# Altium project Pleiades_P01.PrjPcb (part 3 of 10)

## Sheet POWER_FPGA.SchDoc
size Tabloid; SheetNumber: 23; SheetTotal: 25; Sheet_Name: POWER; Size: 11x17
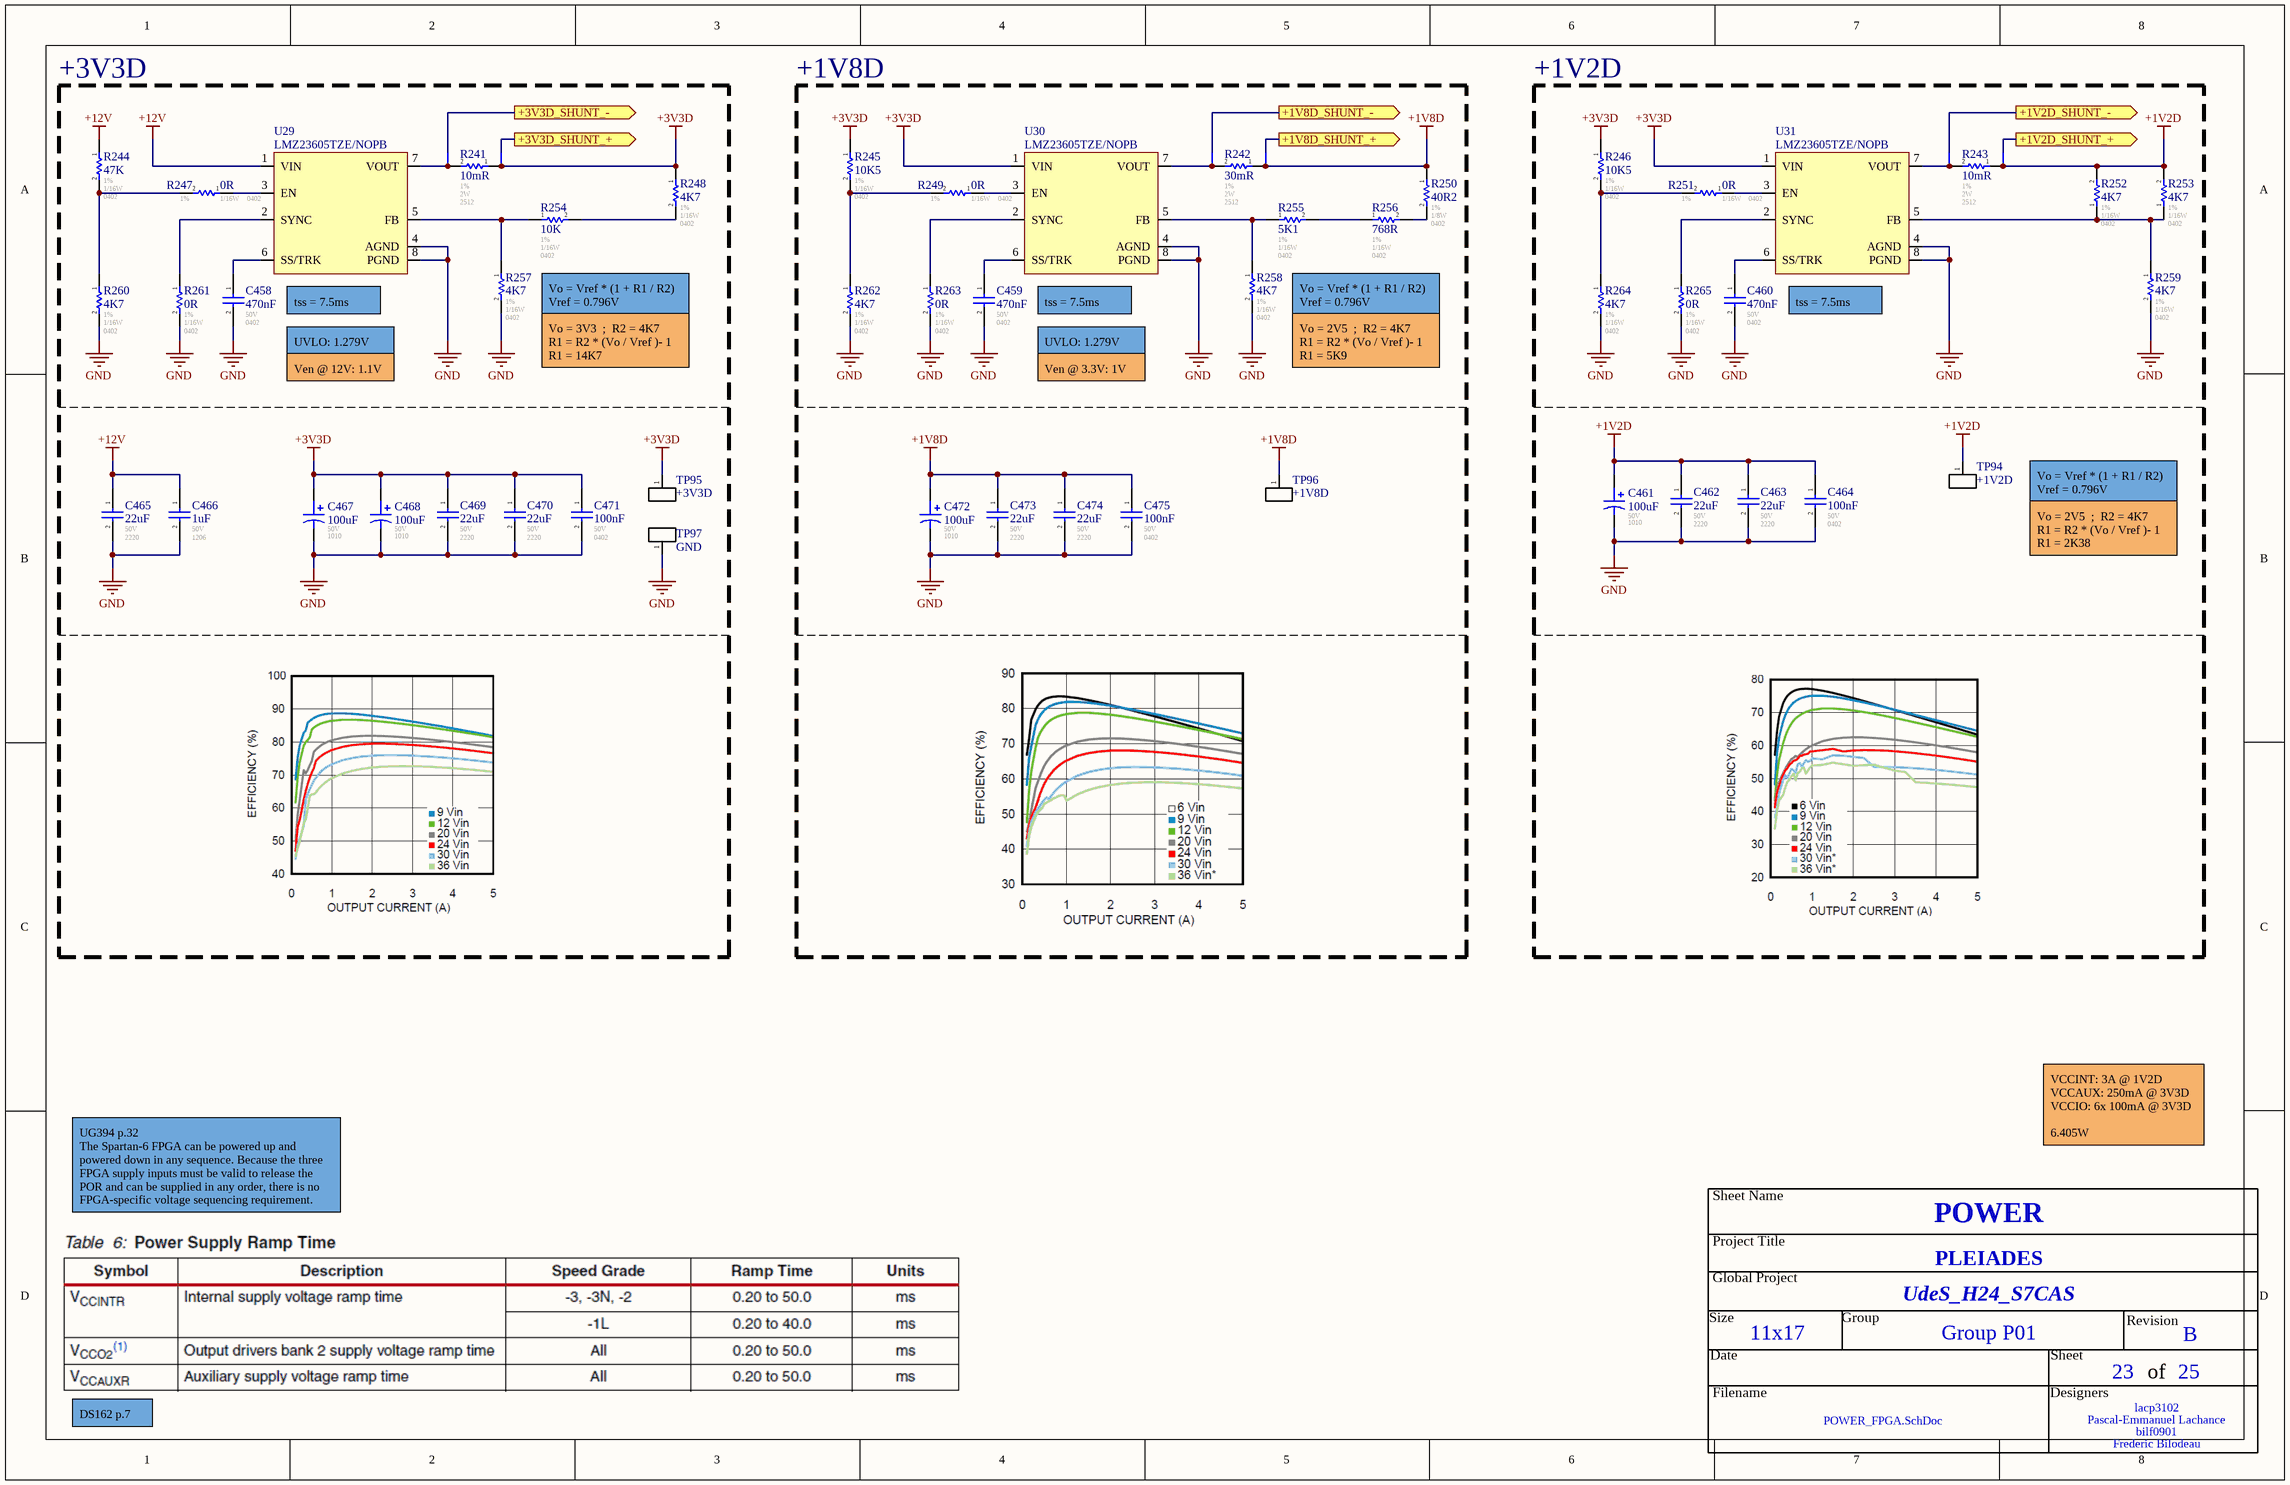
[diagram p16: POWER_FPGA.SchDoc]

### Parts
C458  470nF  Voltage - Rated: 50V  Footprint: 0402  [CAP_0402]
C459  470nF  Voltage - Rated: 50V  Footprint: 0402  [CAP_0402]
C460  470nF  Voltage - Rated: 50V  Footprint: 0402  [CAP_0402]
C461  value 100uF  Voltage: 50V  Package: 1010  [CAP_ALU_1010_vishay]  (hidden comment: MAL215099101E3)
C462  22uF  Voltage - Rated: 50V  Footprint: 2220  [CAP_2220]
C463  22uF  Voltage - Rated: 50V  Footprint: 2220  [CAP_2220]
C464  100nF  Voltage - Rated: 50V  Footprint: 0402  [CAP_0402]
C465  22uF  Voltage - Rated: 50V  Footprint: 2220  [CAP_2220]
C466  1uF  Voltage - Rated: 50V  Footprint: 1206  [CAP_1206]
C467  value 100uF  Voltage: 50V  Package: 1010  [CAP_ALU_1010_vishay]  (hidden comment: MAL215099101E3)
C468  value 100uF  Voltage: 50V  Package: 1010  [CAP_ALU_1010_vishay]  (hidden comment: MAL215099101E3)
C469  22uF  Voltage - Rated: 50V  Footprint: 2220  [CAP_2220]
C470  22uF  Voltage - Rated: 50V  Footprint: 2220  [CAP_2220]
C471  100nF  Voltage - Rated: 50V  Footprint: 0402  [CAP_0402]
C472  value 100uF  Voltage: 50V  Package: 1010  [CAP_ALU_1010_vishay]  (hidden comment: MAL215099101E3)
C473  22uF  Voltage - Rated: 50V  Footprint: 2220  [CAP_2220]
C474  22uF  Voltage - Rated: 50V  Footprint: 2220  [CAP_2220]
C475  100nF  Voltage - Rated: 50V  Footprint: 0402  [CAP_0402]
NT46  Net Tie  [NETTIE_5]  (value not drawn)  (net tie, no BOM)
NT47  Net Tie  [NETTIE_5]  (value not drawn)  (net tie, no BOM)
NT48  Net Tie  [NETTIE_5]  (value not drawn)  (net tie, no BOM)
NT49  Net Tie  [NETTIE_5]  (value not drawn)  (net tie, no BOM)
NT50  Net Tie  [NETTIE_5]  (value not drawn)  (net tie, no BOM)
NT51  Net Tie  [NETTIE_5]  (value not drawn)  (net tie, no BOM)
R241  10mR  Tolerance: 1%  Power: 2W  Package / Case: 2512  [RES_2512]
R242  30mR  Tolerance: 1%  Power: 2W  Package / Case: 2512  [RES_2512]
R243  10mR  Tolerance: 1%  Power: 2W  Package / Case: 2512  [RES_2512]
R244  47K  Tolerance: 1%  Power: 1/16W  Package / Case: 0402  [RES_0402]
R245  10K5  Tolerance: 1%  Power: 1/16W  Package / Case: 0402  [RES_0402]
R246  10K5  Tolerance: 1%  Power: 1/16W  Package / Case: 0402  [RES_0402]
R247  0R  Tolerance: 1%  Power: 1/16W  Package / Case: 0402  [RES_0402]
R248  4K7  Tolerance: 1%  Power: 1/16W  Package / Case: 0402  [RES_0402]
R249  0R  Tolerance: 1%  Power: 1/16W  Package / Case: 0402  [RES_0402]
R250  40R2  Tolerance: 1%  Power: 1/8W  Package / Case: 0402  [RES_0402]
R251  0R  Tolerance: 1%  Power: 1/16W  Package / Case: 0402  [RES_0402]
R252  4K7  Tolerance: 1%  Power: 1/16W  Package / Case: 0402  [RES_0402]
R253  4K7  Tolerance: 1%  Power: 1/16W  Package / Case: 0402  [RES_0402]
R254  10K  Tolerance: 1%  Power: 1/16W  Package / Case: 0402  [RES_0402]
R255  5K1  Tolerance: 1%  Power: 1/16W  Package / Case: 0402  [RES_0402]
R256  768R  Tolerance: 1%  Power: 1/16W  Package / Case: 0402  [RES_0402]
R257  4K7  Tolerance: 1%  Power: 1/16W  Package / Case: 0402  [RES_0402]
R258  4K7  Tolerance: 1%  Power: 1/16W  Package / Case: 0402  [RES_0402]
R259  4K7  Tolerance: 1%  Power: 1/16W  Package / Case: 0402  [RES_0402]
R260  4K7  Tolerance: 1%  Power: 1/16W  Package / Case: 0402  [RES_0402]
R261  0R  Tolerance: 1%  Power: 1/16W  Package / Case: 0402  [RES_0402]
R262  4K7  Tolerance: 1%  Power: 1/16W  Package / Case: 0402  [RES_0402]
R263  0R  Tolerance: 1%  Power: 1/16W  Package / Case: 0402  [RES_0402]
R264  4K7  Tolerance: 1%  Power: 1/16W  Package / Case: 0402  [RES_0402]
R265  0R  Tolerance: 1%  Power: 1/16W  Package / Case: 0402  [RES_0402]
TP94  +1V2D  [TP_HOLE]  (no BOM)
TP95  +3V3D  [TP_HOLE]  (no BOM)
TP96  +1V8D  [TP_HOLE]  (no BOM)
TP97  GND  [TP_HOLE]  (no BOM)
U29  LMZ23605TZE/NOPB  [REG_SWR_LMZ23605TZE/NOPB]
U30  LMZ23605TZE/NOPB  [REG_SWR_LMZ23605TZE/NOPB]
U31  LMZ23605TZE/NOPB  [REG_SWR_LMZ23605TZE/NOPB]

### Blocks framed on the sheet
+3V3D: C458 C465-C471 NT46 NT47 R241 R244 R247 R248 R254 R257 R260 R261 TP95 TP97 U29
+1V8D: C459 C472-C475 NT48 NT49 R242 R245 R249 R250 R255 R256 R258 R262 R263 TP96 U30
+1V2D: C460-C464 NT50 NT51 R243 R246 R251-R253 R259 R264 R265 TP94 U31

### Ports
+1V2D_SHUNT_+ (out), +1V2D_SHUNT_- (out), +1V8D_SHUNT_+ (out), +1V8D_SHUNT_- (out), +3V3D_SHUNT_+ (out), +3V3D_SHUNT_- (out)

### Nets
+1V2D: C461.1 C462.1 C463.1 C464.1 NT51.1 R243.1 R252.2 R253.2 TP94.1(A)
+1V8D: C472.1 C473.1 C474.1 C475.1 NT49.1 R242.1 R250.1 TP96.1(A)
+3V3D: C467.1 C468.1 C469.1 C470.1 C471.1 NT47.1 R241.1 R245.1 R246.1 R248.1 TP95.1(A) U30.1(VIN) U31.1(VIN)
+12V: C465.1 C466.1 R244.1 U29.1(VIN)
GND: C458.2 C459.2 C460.2 C461.2 C462.2 C463.2 C464.2 C465.2 C466.2 C467.2 C468.2 C469.2 C470.2 C471.2 C472.2 C473.2 C474.2 C475.2 R257.2 R258.2 R259.2 R260.2 R261.2 R262.2 R263.2 R264.2 R265.2 TP97.1(A) U29.4(AGND) U29.8(PGND) U30.4(AGND) U30.8(PGND) U31.4(AGND) U31.8(PGND)
+1V2D_SHUNT_+: NT51.2 ; port +1V2D_SHUNT_+
+1V2D_SHUNT_-: NT50.2 ; port +1V2D_SHUNT_-
+1V8D_SHUNT_+: NT49.2 ; port +1V8D_SHUNT_+
+1V8D_SHUNT_-: NT48.2 ; port +1V8D_SHUNT_-
+3V3D_SHUNT_+: NT47.2 ; port +3V3D_SHUNT_+
+3V3D_SHUNT_-: NT46.2 ; port +3V3D_SHUNT_-
NetC458_1: C458.1 U29.6(SS/TRK)
NetC459_1: C459.1 U30.6(SS/TRK)
NetC460_1: C460.1 U31.6(SS/TRK)
NetNT46_1: NT46.1 R241.2 U29.7(VOUT)
NetNT48_1: NT48.1 R242.2 U30.7(VOUT)
NetNT50_1: NT50.1 R243.2 U31.7(VOUT)
NetR244_2: R244.2 R247.2 R260.1
NetR245_2: R245.2 R249.2 R262.1
NetR246_2: R246.2 R251.2 R264.1
NetR247_1: R247.1 U29.3(EN)
NetR248_2: R248.2 R254.2
NetR249_1: R249.1 U30.3(EN)
NetR250_2: R250.2 R256.2
NetR251_1: R251.1 U31.3(EN)
NetR252_1: R252.1 R253.1 R259.1 U31.5(FB)
NetR254_1: R254.1 R257.1 U29.5(FB)
NetR255_1: R255.1 R258.1 U30.5(FB)
NetR255_2: R255.2 R256.1
NetR261_1: R261.1 U29.2(SYNC)
NetR263_1: R263.1 U30.2(SYNC)
NetR265_1: R265.1 U31.2(SYNC)

### Notes on the sheet
- (near U29) tss = 7.5ms
- UVLO: 1.279V
- Vo = Vref * (1 + R1 / R2)
  Vref = 0.796V
- (near R257) Vo = 3V3  ;  R2 = 4K7
  R1 = R2 * (Vo / Vref )- 1
  R1 = 14K7
- (near U30) tss = 7.5ms
- (near R258) Vo = 2V5  ;  R2 = 4K7
  R1 = R2 * (Vo / Vref )- 1
  R1 = 5K9
- (near U31) tss = 7.5ms
- Ven @ 12V: 1.1V
- Ven @ 3.3V: 1V
- Vo = 2V5  ;  R2 = 4K7
  R1 = R2 * (Vo / Vref )- 1
  R1 = 2K38
- VCCINT: 3A @ 1V2D
  VCCAUX: 250mA @ 3V3D
  VCCIO: 6x 100mA @ 3V3D
  6.405W
- UG394 p.32
  The Spartan-6 FPGA can be powered up and powered down in any sequence. Because the three FPGA supply inputs must be valid to release the POR and can be supplied in any order, there is no FPGA-specific voltage sequencing requirement.
- DS162 p.7
- Sheet Name
- Project Title
- Global Project
- Revision
- Size
- Date
- Group
- Sheet
- of
- Filename
- Designers

### Library data of the parts
C458-C460 = CAP_CER: CGA3E3X7R1H474K080AB / 0603 470nF 10% X7R Ceramic Capacitor; Mfr: TDK; Operating Temperature: -55C - 125C; Temperature Coefficient: X7R; ComponentLink1Description: Digikey; ComponentLink1URL: [Digikey Link]; Part#: CGA3E3X7R1H474K080AB; ComponentLink2Description: Datasheet; ComponentLink2URL: [Datasheet Link]; Tolerance: 10%; Ratings: AEC-Q200
C461 C467 C468 C472 = CAP_ALU_MAL215099101E3: CAP - ALU 100uF 20% 50V - 1010; Current: 490mA; Mfg: Vishay Dale; Mfg Part Number: MAL215099101E3; HelpURL: http://www.vishay.com/docs/28395/150crz.pdf; CreatedBy: Jonathan Bouchard; Temperature: -55°C to 125°C; Power: *; Supplier 1: Digikey; Supplier Part Number 1: 4399PHDKR-ND; Precision: 20%
C462 C463 C465 C469 C470 C473 C474 = CAP_CER: CGA9P3X7R1H226M250KB / 2220 22uF 20% X7R Ceramic Capacitor; Mfr: TDK; Operating Temperature: -55C - 125C; Temperature Coefficient: X7R; ComponentLink1Description: Digikey; ComponentLink1URL: https://www.digikey.ca/en/products/detail/tdk-corporation/CGA9P3X7R1H226M250KB/10240627; ComponentLink2Description: Datasheet; ComponentLink2URL: https://product.tdk.com/system/files/dam/doc/product/capacitor/ceramic/mlcc/charasheet/cga9p3x7r1h226m250kb.pdf; Tolerance: 20%; Ratings: AEC-Q200; Part#: CGA9P3X7R1H226M250KB; Supplier 1: Arrow Electronics; Supplier Part Number 1: CGA9P3X7R1H226M250KB; ComponentLink3Description: TDK; ComponentLink3URL: https://product.tdk.com/en/search/capacitor/ceramic/mlcc/info?part_no=CGA9P3X7R1H226M250KB; ComponentLink4Description: Octopart; ComponentLink4URL: https://octopart.com/cga9p3x7r1h226m250kb-tdk-102764996?r=sp
C464 C471 C475 = CAP_CER: GCM155R71H104KE02J / 0402 100nF 10% X7R Ceramic Capacitor; Mfr: Murata; Operating Temperature: -55C - 125C; Temperature Coefficient: X7R; ComponentLink1Description: Digikey; ComponentLink1URL: [Digikey Link]; Part#: GCM155R71H104KE02J; ComponentLink2Description: Datasheet; ComponentLink2URL: [Datasheet Link]; Tolerance: 10%; Ratings: AEC-Q200
C466 = CAP_CER: GCJ31CR71H105KA12L / 1206 1uF 10% X7R Ceramic Capacitor; Mfr: Murata; Operating Temperature: -55C - 125C; Temperature Coefficient: X7R; ComponentLink1Description: Digikey; ComponentLink1URL: [Digikey Link]; Part#: GCJ31CR71H105KA12L; ComponentLink2Description: Datasheet; ComponentLink2URL: [Datasheet Link]; Tolerance: 10%; Ratings: AEC-Q200
NT46-NT51 = NET_TIE_SMALL
R241 R243 = RESISTOR: CSRN2512FK10L0; Automotive: AEC-Q200; Operating Temperature: -55C - 155C; ComponentLink1Description: Digikey; ComponentLink1URL: https://www.digikey.ca/fr/products/detail/stackpole-electronics-inc/CSRN2512FK10L0/1646104; Part #: CSRN2512FK10L0
R242 = RESISTOR: CSRN2512FK30L0; Automotive: AEC-Q200; Operating Temperature: -55C - 155C; ComponentLink1Description: Digikey; ComponentLink1URL: https://www.digikey.ca/fr/products/detail/stackpole-electronics-inc/CSRN2512FK30L0/1646107; Part #: CSRN2512FK30L0
R244-R265 = RESISTOR: Automotive: AEC-Q200; Operating Temperature: *; # Digikey: *; ComponentLink1Description: Digikey; ComponentLink1URL: *; # Manufacturer: *
TP94-TP97 = TESTPOINT: Test Point; ClassName: Testpoint
U29-U31 = REG_SWR_LMZ23605TZE/NOPB: REG - IC BUCK SYNC 36V 5A - TO-PMOD-7; Manufacturer #1: Texas Instruments; Value: 0.8 ~ 6 V; Voltage Rating: 6 ~ 36 V; GRAMS Lib Spec: 2.8; Note: One Reflow; Magnetic Material: YES; Cryo: UNKNOWN; Tolerance: *; Current Rating: 5A; Power Max: *; HelpURL: http://www.ti.com/lit/ds/symlink/lmz23605.pdf; CreatedBy/Date: Arnaud Samson - 05/07/18; VerifiedBy: Jonathan Bouchard 2018-07-13; Temperature: -40°C ~ 125°C; Package: TO-PMOD-7; Manufacturer #2: *; Assembly Type: SMD; Part Number #2: *; Part Number #1: LMZ23605TZE/NOPB; Polarized: YES; Supplier 1: Digi-Key; Supplier Part Number 1: 296-35357-1-ND

## Sheet POWER_DDR3.SchDoc
size Tabloid; SheetNumber: 22; SheetTotal: 25; Sheet_Name: DDR3 POWER; Size: 11x17
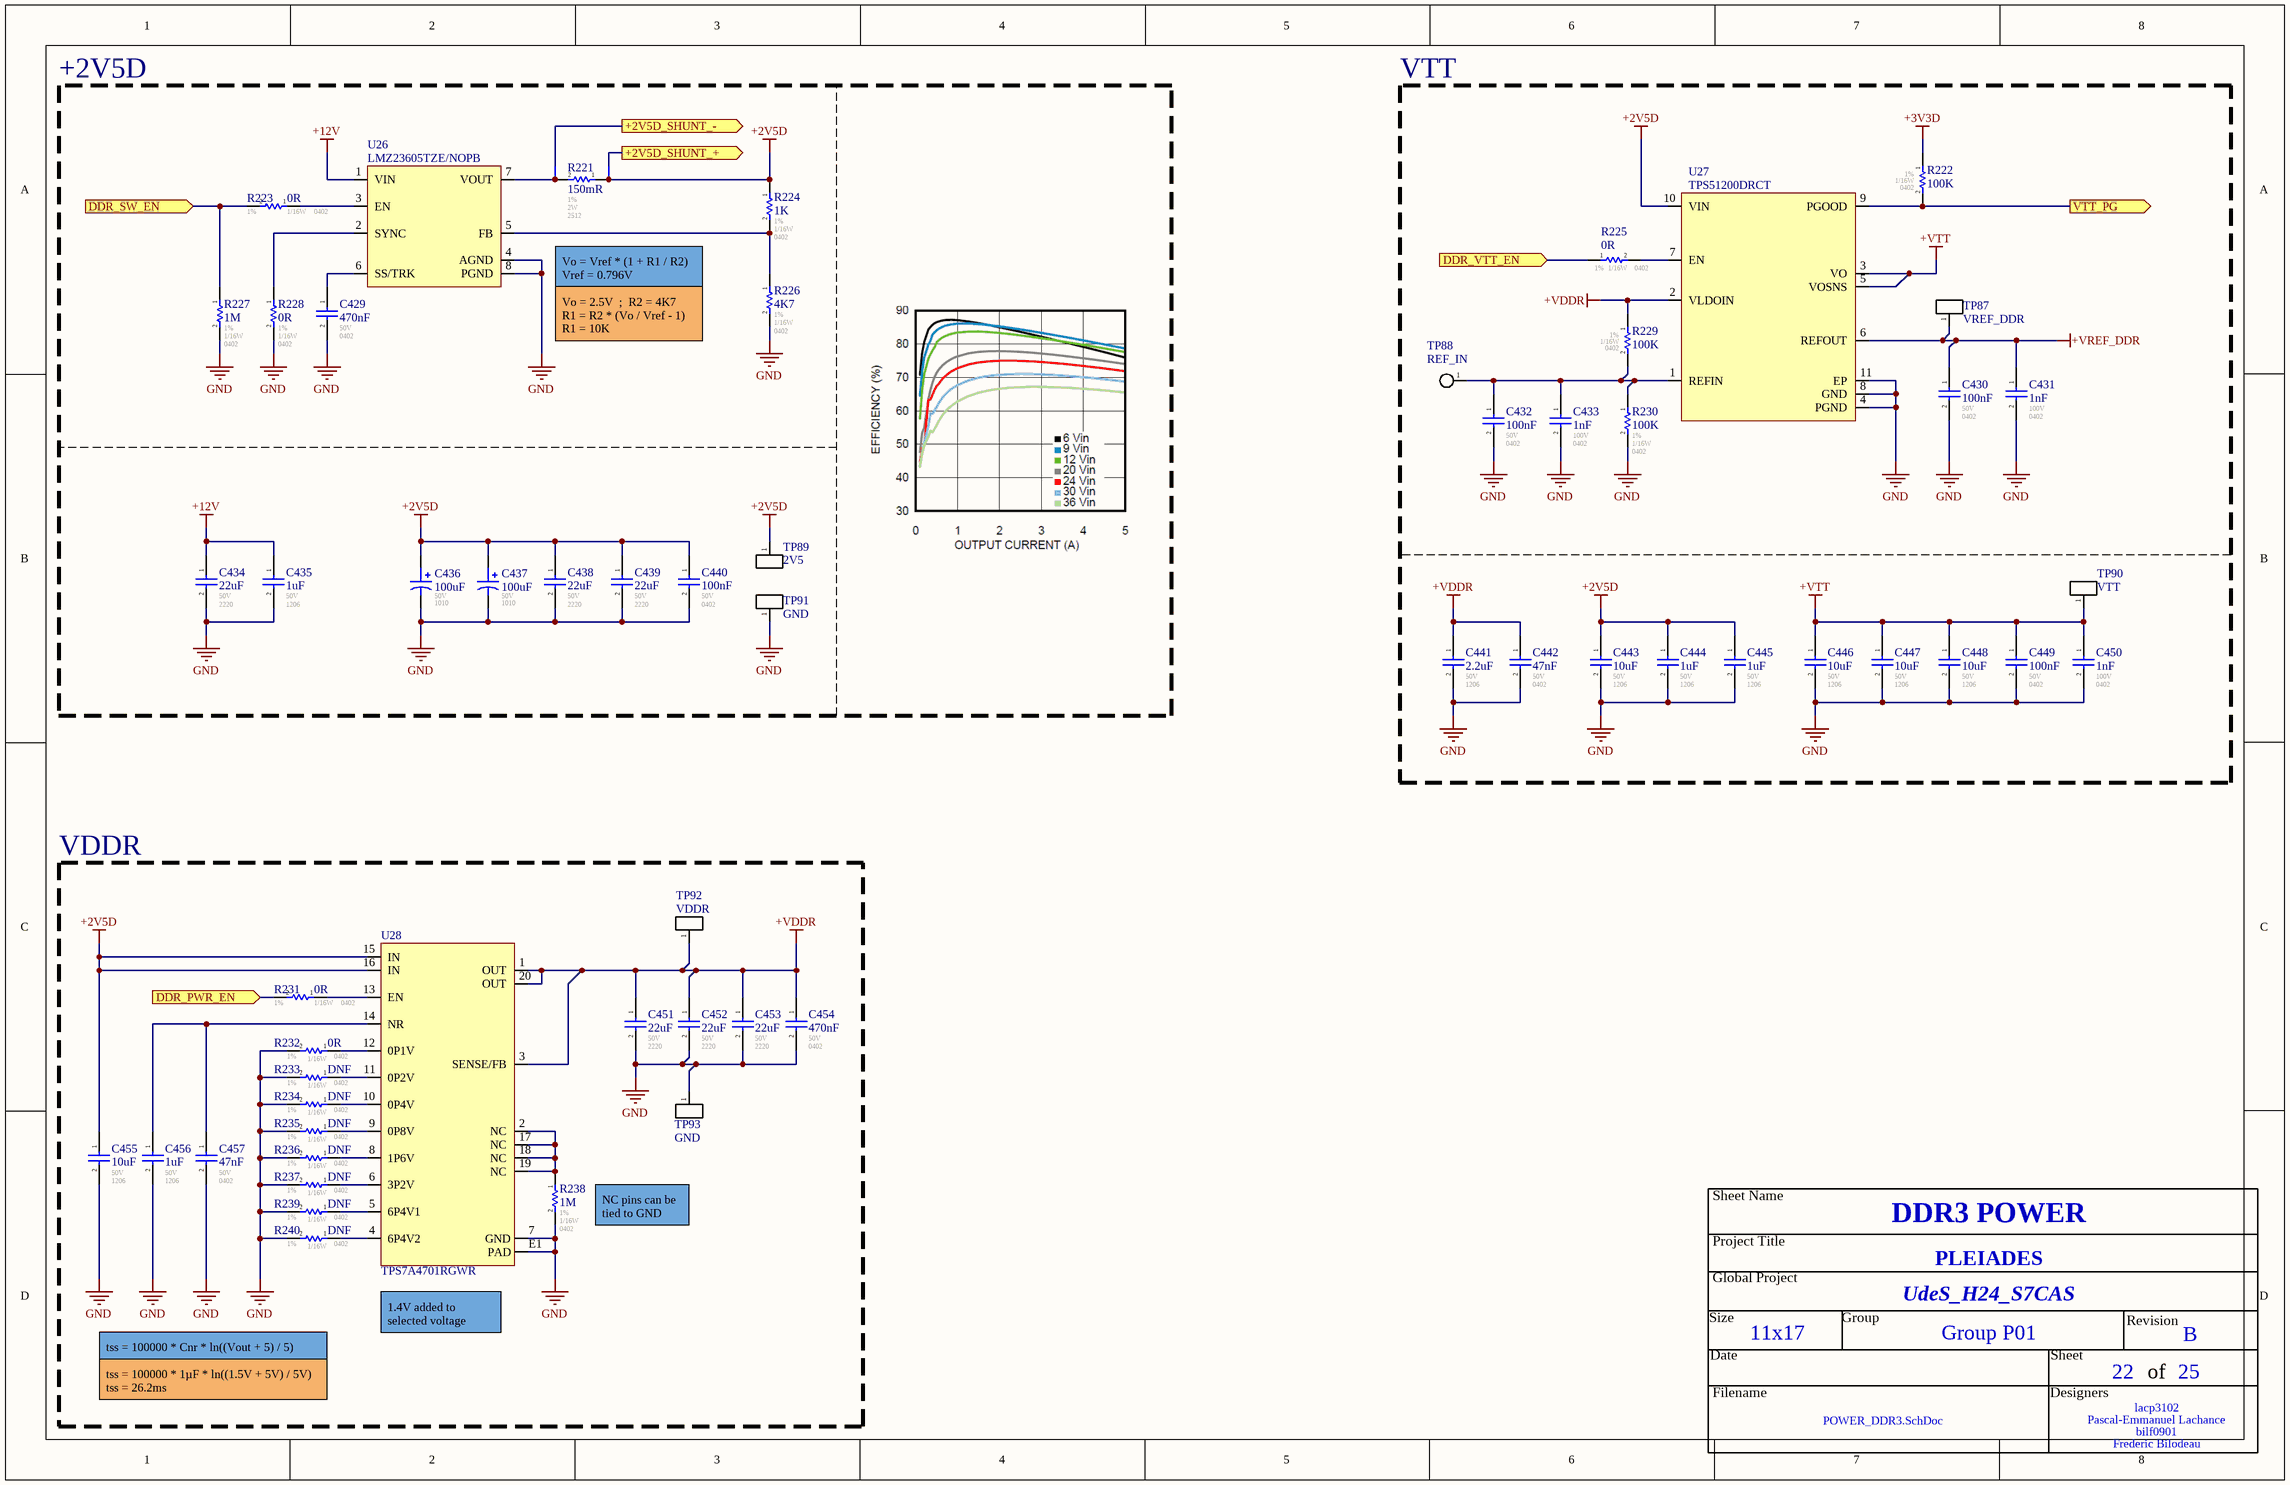
[diagram p17: POWER_DDR3.SchDoc]

### Parts
C429  470nF  Voltage - Rated: 50V  Footprint: 0402  [CAP_0402]
C430  100nF  Voltage - Rated: 50V  Footprint: 0402  [CAP_0402]
C431  1nF  Voltage - Rated: 100V  Footprint: 0402  [CAP_0402]
C432  100nF  Voltage - Rated: 50V  Footprint: 0402  [CAP_0402]
C433  1nF  Voltage - Rated: 100V  Footprint: 0402  [CAP_0402]
C434  22uF  Voltage - Rated: 50V  Footprint: 2220  [CAP_2220]
C435  1uF  Voltage - Rated: 50V  Footprint: 1206  [CAP_1206]
C436  value 100uF  Voltage: 50V  Package: 1010  [CAP_ALU_1010_vishay]  (hidden comment: MAL215099101E3)
C437  value 100uF  Voltage: 50V  Package: 1010  [CAP_ALU_1010_vishay]  (hidden comment: MAL215099101E3)
C438  22uF  Voltage - Rated: 50V  Footprint: 2220  [CAP_2220]
C439  22uF  Voltage - Rated: 50V  Footprint: 2220  [CAP_2220]
C440  100nF  Voltage - Rated: 50V  Footprint: 0402  [CAP_0402]
C441  2.2uF  Voltage - Rated: 50V  Footprint: 1206  [CAP_1206]
C442  47nF  Voltage - Rated: 50V  Footprint: 0402  [CAP_0402]
C443  10uF  Voltage - Rated: 50V  Footprint: 1206  [CAP_1206]
C444  1uF  Voltage - Rated: 50V  Footprint: 1206  [CAP_1206]
C445  1uF  Voltage - Rated: 50V  Footprint: 1206  [CAP_1206]
C446  10uF  Voltage - Rated: 50V  Footprint: 1206  [CAP_1206]
C447  10uF  Voltage - Rated: 50V  Footprint: 1206  [CAP_1206]
C448  10uF  Voltage - Rated: 50V  Footprint: 1206  [CAP_1206]
C449  100nF  Voltage - Rated: 50V  Footprint: 0402  [CAP_0402]
C450  1nF  Voltage - Rated: 100V  Footprint: 0402  [CAP_0402]
C451  22uF  Voltage - Rated: 50V  Footprint: 2220  [CAP_2220]
C452  22uF  Voltage - Rated: 50V  Footprint: 2220  [CAP_2220]
C453  22uF  Voltage - Rated: 50V  Footprint: 2220  [CAP_2220]
C454  470nF  Voltage - Rated: 50V  Footprint: 0402  [CAP_0402]
C455  10uF  Voltage - Rated: 50V  Footprint: 1206  [CAP_1206]
C456  1uF  Voltage - Rated: 50V  Footprint: 1206  [CAP_1206]
C457  47nF  Voltage - Rated: 50V  Footprint: 0402  [CAP_0402]
NT44  Net Tie  [NETTIE_5]  (value not drawn)  (net tie, no BOM)
NT45  Net Tie  [NETTIE_5]  (value not drawn)  (net tie, no BOM)
R221  150mR  Tolerance: 1%  Power: 2W  Package / Case: 2512  [RES_2512]
R222  100K  Tolerance: 1%  Power: 1/16W  Package / Case: 0402  [RES_0402]
R223  0R  Tolerance: 1%  Power: 1/16W  Package / Case: 0402  [RES_0402]
R224  1K  Tolerance: 1%  Power: 1/16W  Package / Case: 0402  [RES_0402]
R225  0R  Tolerance: 1%  Power: 1/16W  Package / Case: 0402  [RES_0402]
R226  4K7  Tolerance: 1%  Power: 1/16W  Package / Case: 0402  [RES_0402]
R227  1M  Tolerance: 1%  Power: 1/16W  Package / Case: 0402  [RES_0402]
R228  0R  Tolerance: 1%  Power: 1/16W  Package / Case: 0402  [RES_0402]
R229  100K  Tolerance: 1%  Power: 1/16W  Package / Case: 0402  [RES_0402]
R230  100K  Tolerance: 1%  Power: 1/16W  Package / Case: 0402  [RES_0402]
R231  0R  Tolerance: 1%  Power: 1/16W  Package / Case: 0402  [RES_0402]
R232  0R  Tolerance: 1%  Power: 1/16W  Package / Case: 0402  [RES_0402]
R233  DNF  Tolerance: 1%  Power: 1/16W  Package / Case: 0402  [RES_0402]
R234  DNF  Tolerance: 1%  Power: 1/16W  Package / Case: 0402  [RES_0402]
R235  DNF  Tolerance: 1%  Power: 1/16W  Package / Case: 0402  [RES_0402]
R236  DNF  Tolerance: 1%  Power: 1/16W  Package / Case: 0402  [RES_0402]
R237  DNF  Tolerance: 1%  Power: 1/16W  Package / Case: 0402  [RES_0402]
R238  1M  Tolerance: 1%  Power: 1/16W  Package / Case: 0402  [RES_0402]
R239  DNF  Tolerance: 1%  Power: 1/16W  Package / Case: 0402  [RES_0402]
R240  DNF  Tolerance: 1%  Power: 1/16W  Package / Case: 0402  [RES_0402]
TP87  VREF_DDR  [TP_HOLE]  (no BOM)
TP88  REF_IN  [TP_PAD_SMALL]  (no BOM)
TP89  2V5  [TP_HOLE]  (no BOM)
TP90  VTT  [TP_HOLE]  (no BOM)
TP91  GND  [TP_HOLE]  (no BOM)
TP92  VDDR  [TP_HOLE]  (no BOM)
TP93  GND  [TP_HOLE]  (no BOM)
U26  LMZ23605TZE/NOPB  [REG_SWR_LMZ23605TZE/NOPB]
U27  TPS51200DRCT  [REG_PMIC_TPS51200DRCT]
U28  TPS7A4701RGWR  [REG_TPS7A4701RGWR]

### Blocks framed on the sheet
+2V5D: C429 C434-C440 NT44 NT45 R221 R223 R224 R226-R228 TP89 TP91 U26
VTT: C430-C433 C441-C450 R222 R225 R229 R230 TP87 TP88 TP90 U27
VDDR: C451-C457 R231-R240 TP92 TP93 U28

### Ports
+2V5D_SHUNT_+ (out), +2V5D_SHUNT_- (out), DDR_PWR_EN (in), DDR_SW_EN (in), DDR_VTT_EN (in), VTT_PG (out)

### Nets
+2V5D: C436.1 C437.1 C438.1 C439.1 C440.1 C443.1 C444.1 C445.1 C455.1 NT45.1 R221.1 R224.1 TP89.1(A) U27.10(VIN) U28.15(IN) U28.16(IN)
+3V3D: R222.1
+12V: C434.1 C435.1 U26.1(VIN)
+VDDR: C441.1 C442.1 C451.1 C452.1 C453.1 C454.1 R229.1 TP92.1(A) U27.2(VLDOIN) U28.1(OUT) U28.3(SENSE/FB) U28.20(OUT)
+VREF_DDR: C430.1 C431.1 TP87.1(A) U27.6(REFOUT)
+VTT: C446.1 C447.1 C448.1 C449.1 C450.1 TP90.1(A) U27.3(VO) U27.5(VOSNS)
GND: C429.2 C430.2 C431.2 C432.2 C433.2 C434.2 C435.2 C436.2 C437.2 C438.2 C439.2 C440.2 C441.2 C442.2 C443.2 C444.2 C445.2 C446.2 C447.2 C448.2 C449.2 C450.2 C451.2 C452.2 C453.2 C454.2 C455.2 C456.2 C457.2 R226.2 R227.2 R228.2 R230.2 R232.2 R233.2 R234.2 R235.2 R236.2 R237.2 R238.2 R239.2 R240.2 TP91.1(A) TP93.1(A) U26.4(AGND) U26.8(PGND) U27.4(PGND) U27.8(GND) U27.11(EP) U28.7(GND) U28.E1(PAD)
+2V5D_SHUNT_+: NT45.2 ; port +2V5D_SHUNT_+
+2V5D_SHUNT_-: NT44.2 ; port +2V5D_SHUNT_-
DDR_PWR_EN: R231.2 ; port DDR_PWR_EN
DDR_SW_EN: R223.2 R227.1 ; port DDR_SW_EN
DDR_VTT_EN: R225.1 ; port DDR_VTT_EN
VTT_PG: R222.2 U27.9(PGOOD) ; port VTT_PG
NetC429_1: C429.1 U26.6(SS/TRK)
NetC432_1: C432.1 C433.1 R229.2 R230.1 TP88.1(A) U27.1(REFIN)
NetC456_1: C456.1 C457.1 U28.14(NR)
NetNT44_1: NT44.1 R221.2 U26.7(VOUT)
NetR223_1: R223.1 U26.3(EN)
NetR224_2: R224.2 R226.1 U26.5(FB)
NetR225_2: R225.2 U27.7(EN)
NetR228_1: R228.1 U26.2(SYNC)
NetR231_1: R231.1 U28.13(EN)
NetR232_1: R232.1 U28.12(0P1V)
NetR233_1: R233.1 U28.11(0P2V)
NetR234_1: R234.1 U28.10(0P4V)
NetR235_1: R235.1 U28.9(0P8V)
NetR236_1: R236.1 U28.8(1P6V)
NetR237_1: R237.1 U28.6(3P2V)
NetR238_1: R238.1 U28.2(NC) U28.17(NC) U28.18(NC) U28.19(NC)
NetR239_1: R239.1 U28.5(6P4V1)
NetR240_1: R240.1 U28.4(6P4V2)

### Notes on the sheet
- Vo = Vref * (1 + R1 / R2)
  Vref = 0.796V
- Vo = 2.5V  ;  R2 = 4K7
  R1 = R2 * (Vo / Vref - 1)
  R1 = 10K
- (near R238) NC pins can be tied to GND
- tss = 100000 * Cnr * ln((Vout + 5) / 5)
- (near U28) 1.4V added to selected voltage
- tss = 100000 * 1µF * ln((1.5V + 5V) / 5V)
  tss = 26.2ms
- Sheet Name
- Project Title
- Global Project
- Revision
- Size
- Date
- Group
- Sheet
- of
- Filename
- Designers

### Library data of the parts
C429 C454 = CAP_CER: as C458-C460 on sheet POWER_FPGA; Operating Temperature: -55C - 125C; Temperature Coefficient: X7R; ComponentLink1Description: Digikey; ComponentLink1URL: [Digikey Link]; Part#: CGA3E3X7R1H474K080AB; ComponentLink2Description: Datasheet; ComponentLink2URL: [Datasheet Link]; Tolerance: 10%; Ratings: AEC-Q200
C430 C432 C440 C449 = CAP_CER: as C464 on sheet POWER_FPGA; Operating Temperature: -55C - 125C; Temperature Coefficient: X7R; ComponentLink1Description: Digikey; ComponentLink1URL: [Digikey Link]; Part#: GCM155R71H104KE02J; ComponentLink2Description: Datasheet; ComponentLink2URL: [Datasheet Link]; Tolerance: 10%; Ratings: AEC-Q200
C431 C433 C450 = CAP_CER: GCM155R72A102KA37D / 0402 1nF 10% X7R Ceramic Capacitor; Mfr: Murata; Operating Temperature: -55C - 125C; Temperature Coefficient: X7R; ComponentLink1Description: Digikey; ComponentLink1URL: [Digikey Link]; Part#: GCM155R72A102KA37D; ComponentLink2Description: Datasheet; ComponentLink2URL: [Datasheet Link]; Tolerance: 10%; Ratings: AEC-Q200
C434 C438 C439 C451-C453 = CAP_CER: as C462 on sheet POWER_FPGA; Operating Temperature: -55C - 125C; Temperature Coefficient: X7R; ComponentLink1Description: Digikey; ComponentLink1URL: https://www.digikey.ca/en/products/detail/tdk-corporation/CGA9P3X7R1H226M250KB/10240627; ComponentLink2Description: Datasheet; ComponentLink2URL: https://product.tdk.com/system/files/dam/doc/product/capacitor/ceramic/mlcc/charasheet/cga9p3x7r1h226m250kb.pdf; Tolerance: 20%; Ratings: AEC-Q200; Part#: CGA9P3X7R1H226M250KB; Supplier 1: Arrow Electronics; Supplier Part Number 1: CGA9P3X7R1H226M250KB; ComponentLink3Description: TDK; ComponentLink3URL: https://product.tdk.com/en/search/capacitor/ceramic/mlcc/info?part_no=CGA9P3X7R1H226M250KB; ComponentLink4Description: Octopart; ComponentLink4URL: https://octopart.com/cga9p3x7r1h226m250kb-tdk-102764996?r=sp
C435 C444 C445 C456 = CAP_CER: as C466 on sheet POWER_FPGA; Operating Temperature: -55C - 125C; Temperature Coefficient: X7R; ComponentLink1Description: Digikey; ComponentLink1URL: [Digikey Link]; Part#: GCJ31CR71H105KA12L; ComponentLink2Description: Datasheet; ComponentLink2URL: [Datasheet Link]; Tolerance: 10%; Ratings: AEC-Q200
C436 C437 = CAP_ALU_MAL215099101E3: as C461 on sheet POWER_FPGA; Mfg Part Number: MAL215099101E3; HelpURL: http://www.vishay.com/docs/28395/150crz.pdf; CreatedBy: Jonathan Bouchard; Temperature: -55°C to 125°C; Power: *; Supplier 1: Digikey; Supplier Part Number 1: 4399PHDKR-ND; Precision: 20%
C441 = CAP_CER: GRT31CR71H225KE13L / 1206 2.2uF 10% X7R Ceramic Capacitor; Mfr: Murata; Operating Temperature: -55C - 125C; Temperature Coefficient: X7R; ComponentLink1Description: Digikey; ComponentLink1URL: https://www.digikey.ca/en/products/detail/murata-electronics/GRT31CR71H225KE13L/10700891; Part#: GRT31CR71H225KE13L; ComponentLink2Description: Datasheet; ComponentLink2URL: https://search.murata.co.jp/Ceramy/image/img/A01X/G101/ENG/GRT31CR71H225KE13-01A.pdf; ComponentLink3Description: Octopart; ComponentLink3URL: https://octopart.com/grt31cr71h225ke13l-murata-76584457?r=sp; ComponentLink4Description: Murata; ComponentLink4URL: https://www.murata.com/en-us/products/productdetail?partno=GRT31CR71H225KE13%23; Tolerance: 10%; Ratings: AEC-Q200
C442 C457 = CAP_CER: GCM155R71H473KE02J / 0402 47nF 10% X7R Ceramic Capacitor; Mfr: Murata; Operating Temperature: -55C - 125C; Temperature Coefficient: X7R; ComponentLink1Description: Digikey; ComponentLink1URL: [Digikey Link]; Part#: GCM155R71H473KE02J; ComponentLink2Description: Datasheet; ComponentLink2URL: [Datasheet Link]; Tolerance: 10%; Ratings: AEC-Q200
C443 C446-C448 C455 = CAP_CER: GRT31CR61H106KE01L / 1206 10uF 10% X5R Ceramic Capacitor; Mfr: Murata; Operating Temperature: -55C - 85C; Temperature Coefficient: X5R; ComponentLink1Description: Digikey; ComponentLink1URL: [Digikey Link]; ComponentLink2Description: Datasheet; ComponentLink2URL: [Datasheet Link]; Tolerance: 10%; Ratings: AEC-Q200; Supplier 1: Arrow Electronics; Supplier Part Number 1: GRT31CR61H106KE01L; Part#: GRT31CR61H106KE01L
NT44 NT45 = NET_TIE_SMALL
R221 = RESISTOR: CSRN2512FKR150; Automotive: AEC-Q200; Operating Temperature: -55C - 155C; ComponentLink1Description: Digikey; ComponentLink1URL: https://www.digikey.ca/fr/products/detail/stackpole-electronics-inc/CSRN2512FKR150/1788109; Part #: CSRN2512FKR150
R222-R226 R228-R237 R239 R240 = RESISTOR: Automotive: AEC-Q200; Operating Temperature: *; # Digikey: *; ComponentLink1Description: Digikey; ComponentLink1URL: *; # Manufacturer: *
R227 R238 = RESISTOR: 1M 0402 1% 1/16W Resistor; Automotive: AEC-Q200; Operating Temperature: *; # Digikey: *; ComponentLink1Description: Digikey; ComponentLink1URL: *; # Manufacturer: *
TP87 TP89-TP93 = TESTPOINT: Test Point; ClassName: Testpoint
TP88 = TESTPOINT_PAD_SMALL: Test Point
U26 = REG_SWR_LMZ23605TZE/NOPB: as U29 on sheet POWER_FPGA; Tolerance: *; Current Rating: 5A; Power Max: *; HelpURL: http://www.ti.com/lit/ds/symlink/lmz23605.pdf; CreatedBy/Date: Arnaud Samson - 05/07/18; VerifiedBy: Jonathan Bouchard 2018-07-13; Temperature: -40°C ~ 125°C; Package: TO-PMOD-7; Manufacturer #2: *; Assembly Type: SMD; Part Number #2: *; Part Number #1: LMZ23605TZE/NOPB; Polarized: YES; Supplier 1: Digi-Key; Supplier Part Number 1: 296-35357-1-ND
U27 = REG_PMIC_TPS51200DRCT: REG - DDR TERMINATION/REF REG - 10-VFDFN; Manufacturer #1: Texas Instruments; Value: DDR, DDR2, DDR3(L), DDR4; Voltage Rating: 2.375V ~ 3.5V; Current Rating: Source: 3A~4.5A, Sink: 3.5A~5.5A; GRAMS Lib Spec: 2.8; Magnetic Material: Unknown; Polarized: Yes; Tolerance: *; Power Max: *; HelpURL: http://www.ti.com/lit/ds/symlink/tps51200.pdf; CreatedBy/Date: Joel Lemay 2019-03-19; VerifiedBy: Nicolas V. (2019-05-31); Temperature: -40°C ~ 85°C; Package: 10-VFDFN; Manufacturer #2: *; Note: *; Assembly Type: SMD; Part Number #2: *; Part Number #1: TPS51200DRCT; Supplier 1: Digi-Key; Supplier Part Number 1: 296-23830-1-ND; Cryo: UNKNOWN
U28 = REG_LDO_TPS7A4701RGWR: REG - LINEAR POS ADJ 1A - 20VQFN; Manufacturer #1: Texas Instruments; GRAMS Lib Spec: 2.8; Magnetic Material: Unknown; Polarized: Yes; Value: 1.4 à 34V; Voltage rating: 35V max; Assembly Type: SMD; CreatedBy/Date: L-P Gauthier / 2018-05-29; Current Rating: 1A; Manufacturer #2: TBD; Part Number #1: TPS7A4701RGWR; Part Number #2: TBD; Package: 20-VQFN Exposed Pad; Power Max: *; Tolerance: -; Supplier 1: Digi-Key; Supplier Part Number 1: 296-37224-1-ND; VerifiedBy: Caroline Paulin - 28 sept 2018; Temperature: -40°C ~ 125°C; HelpURL: http://www.ti.com/lit/ds/symlink/tps7a47.pdf; Cryo: UNKNOWN

## Sheet POWER_ANALOG.SchDoc
size 558 x 431 mm; SheetNumber: 21; SheetTotal: 25; Sheet_Name: POWER; Size: 11x17
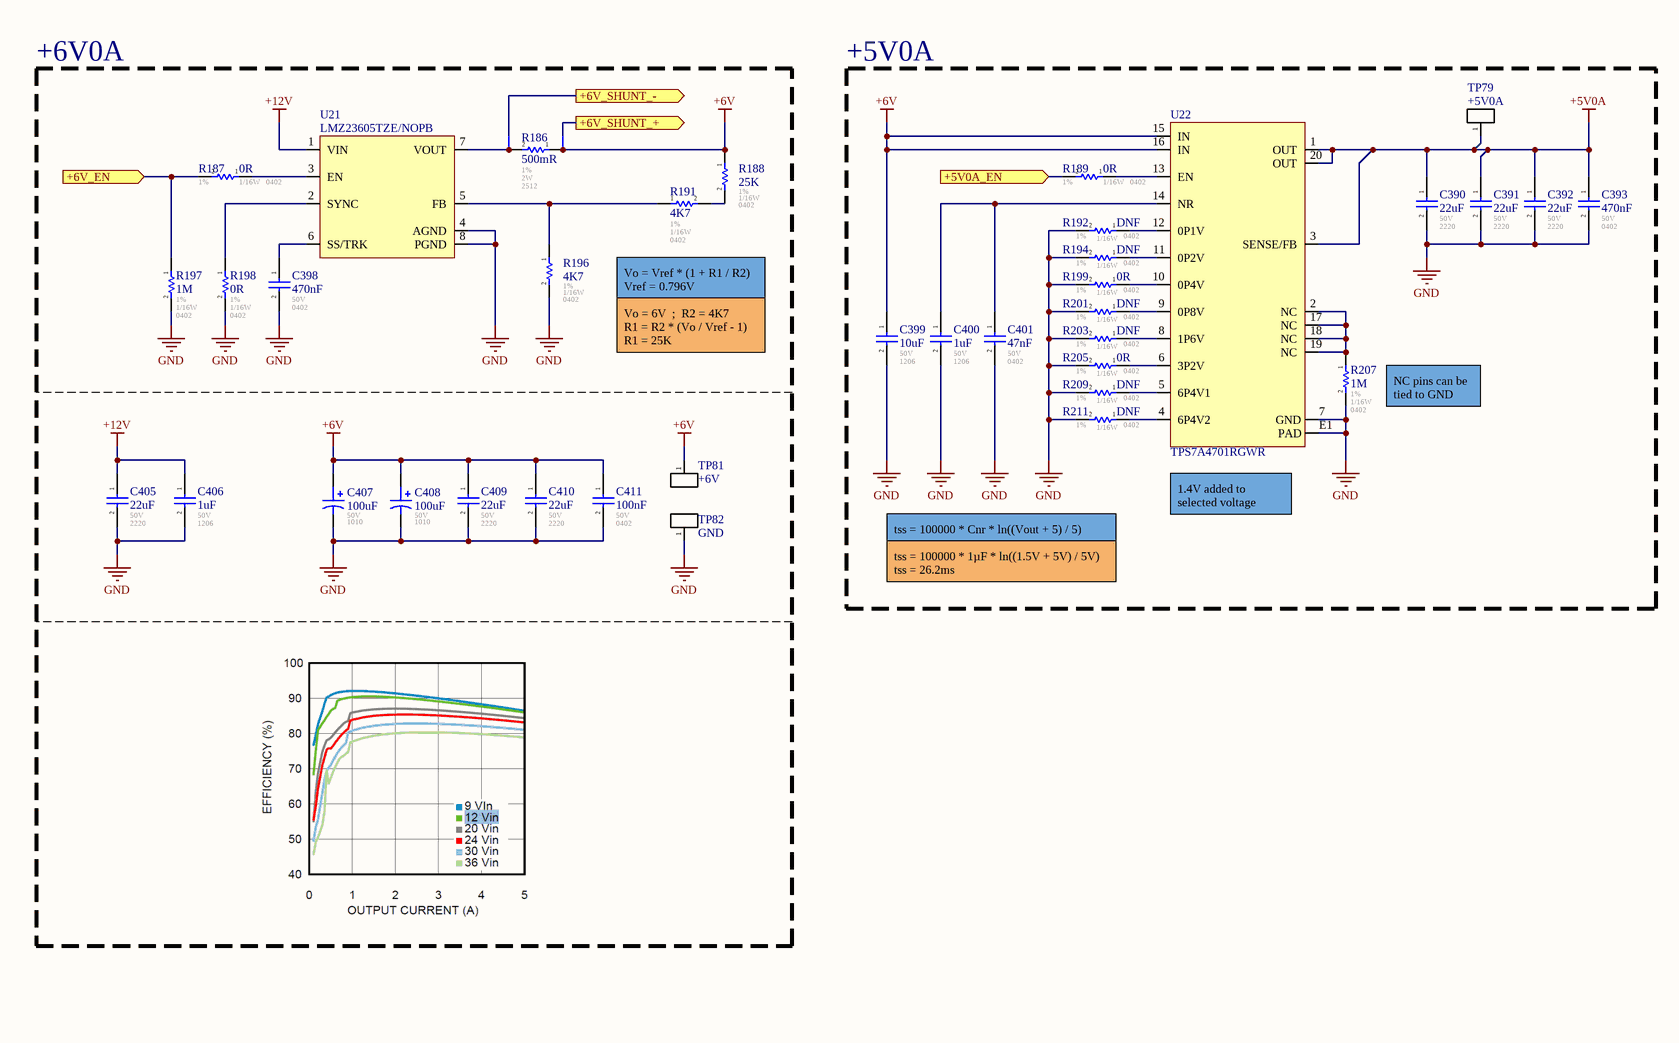
[diagram p18: POWER_ANALOG.SchDoc, top left]
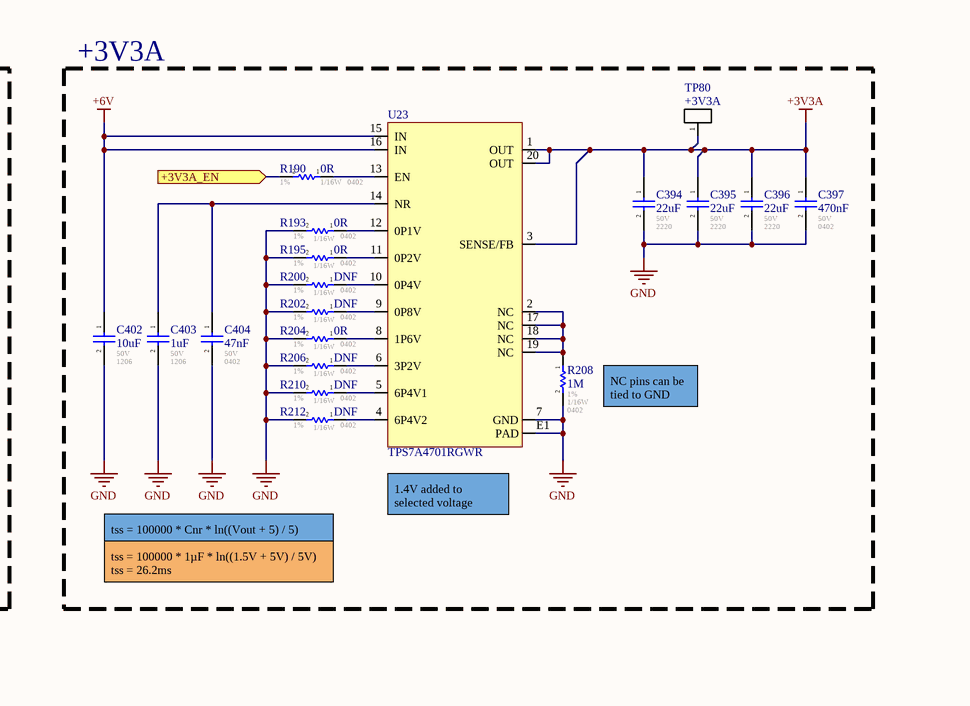
[diagram p19: POWER_ANALOG.SchDoc, top right]
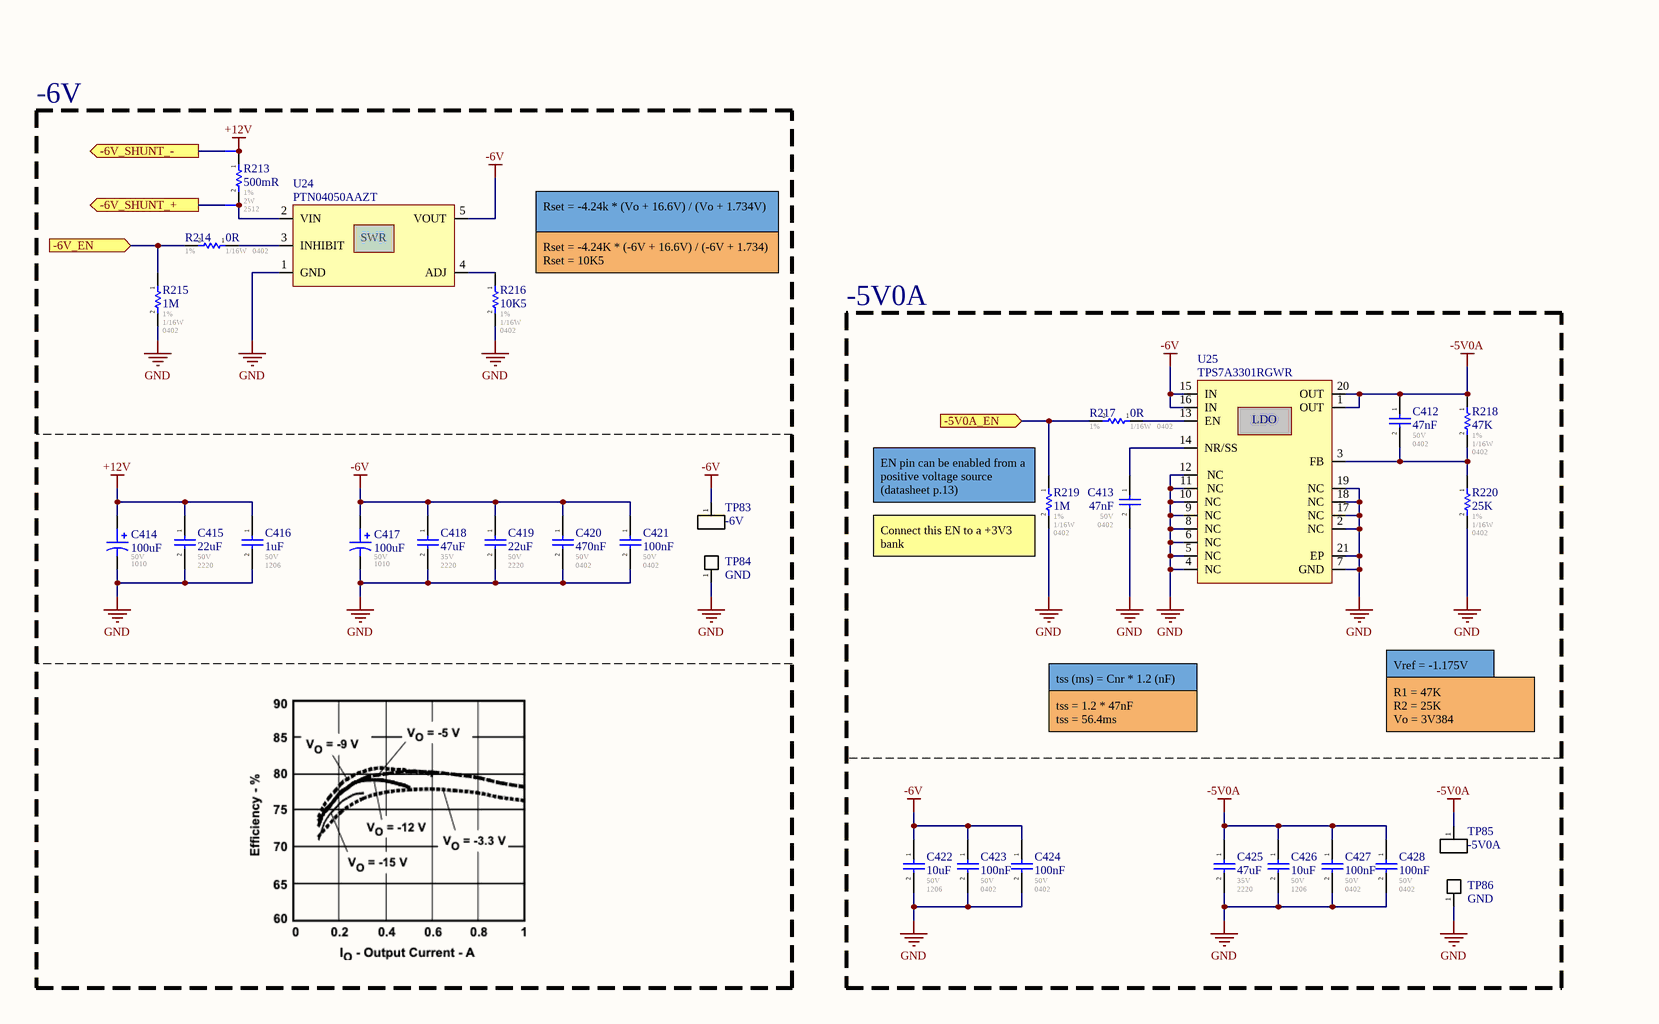
[diagram p20: POWER_ANALOG.SchDoc, bottom left]
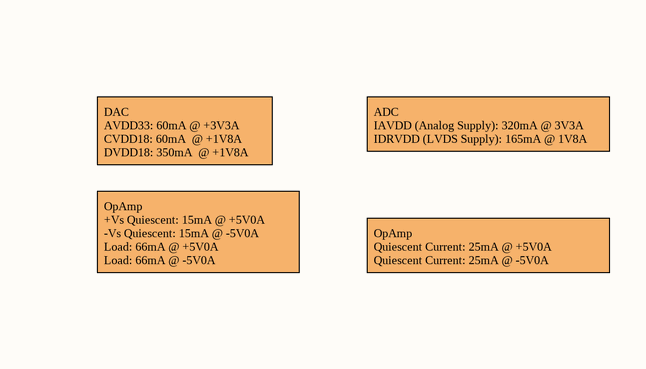
[diagram p21: POWER_ANALOG.SchDoc, bottom right]

### Parts
C390  22uF  Voltage - Rated: 50V  Footprint: 2220  [CAP_2220]
C391  22uF  Voltage - Rated: 50V  Footprint: 2220  [CAP_2220]
C392  22uF  Voltage - Rated: 50V  Footprint: 2220  [CAP_2220]
C393  470nF  Voltage - Rated: 50V  Footprint: 0402  [CAP_0402]
C394  22uF  Voltage - Rated: 50V  Footprint: 2220  [CAP_2220]
C395  22uF  Voltage - Rated: 50V  Footprint: 2220  [CAP_2220]
C396  22uF  Voltage - Rated: 50V  Footprint: 2220  [CAP_2220]
C397  470nF  Voltage - Rated: 50V  Footprint: 0402  [CAP_0402]
C398  470nF  Voltage - Rated: 50V  Footprint: 0402  [CAP_0402]
C399  10uF  Voltage - Rated: 50V  Footprint: 1206  [CAP_1206]
C400  1uF  Voltage - Rated: 50V  Footprint: 1206  [CAP_1206]
C401  47nF  Voltage - Rated: 50V  Footprint: 0402  [CAP_0402]
C402  10uF  Voltage - Rated: 50V  Footprint: 1206  [CAP_1206]
C403  1uF  Voltage - Rated: 50V  Footprint: 1206  [CAP_1206]
C404  47nF  Voltage - Rated: 50V  Footprint: 0402  [CAP_0402]
C405  22uF  Voltage - Rated: 50V  Footprint: 2220  [CAP_2220]
C406  1uF  Voltage - Rated: 50V  Footprint: 1206  [CAP_1206]
C407  value 100uF  Voltage: 50V  Package: 1010  [CAP_ALU_1010_vishay]  (hidden comment: MAL215099101E3)
C408  value 100uF  Voltage: 50V  Package: 1010  [CAP_ALU_1010_vishay]  (hidden comment: MAL215099101E3)
C409  22uF  Voltage - Rated: 50V  Footprint: 2220  [CAP_2220]
C410  22uF  Voltage - Rated: 50V  Footprint: 2220  [CAP_2220]
C411  100nF  Voltage - Rated: 50V  Footprint: 0402  [CAP_0402]
C412  47nF  Voltage - Rated: 50V  Footprint: 0402  [CAP_0402]
C413  47nF  Voltage - Rated: 50V  Footprint: 0402  [CAP_0402]
C414  value 100uF  Voltage: 50V  Package: 1010  [CAP_ALU_1010_vishay]  (hidden comment: MAL215099101E3)
C415  22uF  Voltage - Rated: 50V  Footprint: 2220  [CAP_2220]
C416  1uF  Voltage - Rated: 50V  Footprint: 1206  [CAP_1206]
C417  value 100uF  Voltage: 50V  Package: 1010  [CAP_ALU_1010_vishay]  (hidden comment: MAL215099101E3)
C418  47uF  Voltage - Rated: 35V  Footprint: 2220  [CAP_2220]
C419  22uF  Voltage - Rated: 50V  Footprint: 2220  [CAP_2220]
C420  470nF  Voltage - Rated: 50V  Footprint: 0402  [CAP_0402]
C421  100nF  Voltage - Rated: 50V  Footprint: 0402  [CAP_0402]
C422  10uF  Voltage - Rated: 50V  Footprint: 1206  [CAP_1206]
C423  100nF  Voltage - Rated: 50V  Footprint: 0402  [CAP_0402]
C424  100nF  Voltage - Rated: 50V  Footprint: 0402  [CAP_0402]
C425  47uF  Voltage - Rated: 35V  Footprint: 2220  [CAP_2220]
C426  10uF  Voltage - Rated: 50V  Footprint: 1206  [CAP_1206]
C427  100nF  Voltage - Rated: 50V  Footprint: 0402  [CAP_0402]
C428  100nF  Voltage - Rated: 50V  Footprint: 0402  [CAP_0402]
NT40  Net Tie  [NETTIE_5]  (value not drawn)  (net tie, no BOM)
NT41  Net Tie  [NETTIE_5]  (value not drawn)  (net tie, no BOM)
NT42  Net Tie  [NETTIE_5]  (value not drawn)  (net tie, no BOM)
NT43  Net Tie  [NETTIE_5]  (value not drawn)  (net tie, no BOM)
R186  500mR  Tolerance: 1%  Power: 2W  Package / Case: 2512  [RES_2512]
R187  0R  Tolerance: 1%  Power: 1/16W  Package / Case: 0402  [RES_0402]
R188  25K  Tolerance: 1%  Power: 1/16W  Package / Case: 0402  [RES_0402]
R189  0R  Tolerance: 1%  Power: 1/16W  Package / Case: 0402  [RES_0402]
R190  0R  Tolerance: 1%  Power: 1/16W  Package / Case: 0402  [RES_0402]
R191  4K7  Tolerance: 1%  Power: 1/16W  Package / Case: 0402  [RES_0402]
R192  DNF  Tolerance: 1%  Power: 1/16W  Package / Case: 0402  [RES_0402]
R193  0R  Tolerance: 1%  Power: 1/16W  Package / Case: 0402  [RES_0402]
R194  DNF  Tolerance: 1%  Power: 1/16W  Package / Case: 0402  [RES_0402]
R195  0R  Tolerance: 1%  Power: 1/16W  Package / Case: 0402  [RES_0402]
R196  4K7  Tolerance: 1%  Power: 1/16W  Package / Case: 0402  [RES_0402]
R197  1M  Tolerance: 1%  Power: 1/16W  Package / Case: 0402  [RES_0402]
R198  0R  Tolerance: 1%  Power: 1/16W  Package / Case: 0402  [RES_0402]
R199  0R  Tolerance: 1%  Power: 1/16W  Package / Case: 0402  [RES_0402]
R200  DNF  Tolerance: 1%  Power: 1/16W  Package / Case: 0402  [RES_0402]
R201  DNF  Tolerance: 1%  Power: 1/16W  Package / Case: 0402  [RES_0402]
R202  DNF  Tolerance: 1%  Power: 1/16W  Package / Case: 0402  [RES_0402]
R203  DNF  Tolerance: 1%  Power: 1/16W  Package / Case: 0402  [RES_0402]
R204  0R  Tolerance: 1%  Power: 1/16W  Package / Case: 0402  [RES_0402]
R205  0R  Tolerance: 1%  Power: 1/16W  Package / Case: 0402  [RES_0402]
R206  DNF  Tolerance: 1%  Power: 1/16W  Package / Case: 0402  [RES_0402]
R207  1M  Tolerance: 1%  Power: 1/16W  Package / Case: 0402  [RES_0402]
R208  1M  Tolerance: 1%  Power: 1/16W  Package / Case: 0402  [RES_0402]
R209  DNF  Tolerance: 1%  Power: 1/16W  Package / Case: 0402  [RES_0402]
R210  DNF  Tolerance: 1%  Power: 1/16W  Package / Case: 0402  [RES_0402]
R211  DNF  Tolerance: 1%  Power: 1/16W  Package / Case: 0402  [RES_0402]
R212  DNF  Tolerance: 1%  Power: 1/16W  Package / Case: 0402  [RES_0402]
R213  500mR  Tolerance: 1%  Power: 2W  Package / Case: 2512  [RES_2512]
R214  0R  Tolerance: 1%  Power: 1/16W  Package / Case: 0402  [RES_0402]
R215  1M  Tolerance: 1%  Power: 1/16W  Package / Case: 0402  [RES_0402]
R216  10K5  Tolerance: 1%  Power: 1/16W  Package / Case: 0402  [RES_0402]
R217  0R  Tolerance: 1%  Power: 1/16W  Package / Case: 0402  [RES_0402]
R218  47K  Tolerance: 1%  Power: 1/16W  Package / Case: 0402  [RES_0402]
R219  1M  Tolerance: 1%  Power: 1/16W  Package / Case: 0402  [RES_0402]
R220  25K  Tolerance: 1%  Power: 1/16W  Package / Case: 0402  [RES_0402]
TP79  +5V0A  [TP_HOLE]  (no BOM)
TP80  +3V3A  [TP_HOLE]  (no BOM)
TP81  +6V  [TP_HOLE]  (no BOM)
TP82  GND  [TP_HOLE]  (no BOM)
TP83  -6V  [TP_HOLE]  (no BOM)
TP84  GND  [TP_PAD]  (no BOM)
TP85  -5V0A  [TP_HOLE]  (no BOM)
TP86  GND  [TP_PAD]  (no BOM)
U21  LMZ23605TZE/NOPB  [REG_SWR_LMZ23605TZE/NOPB]
U22  TPS7A4701RGWR  [REG_TPS7A4701RGWR]
U23  TPS7A4701RGWR  [REG_TPS7A4701RGWR]
U24  PTN04050AAZT  [REG_SWR_PTN04050AAZT]
U25  TPS7A3301RGWR  [REG_LDO_TPS7A3301RGWR]

### Blocks framed on the sheet
+6V0A: C398 C405-C411 NT40 NT41 R186-R188 R191 R196-R198 TP81 TP82 U21
+5V0A: C390-C393 C399-C401 R189 R192 R194 R199 R201 R203 R205 R207 R209 R211 TP79 U22
+3V3A: C394-C397 C402-C404 R190 R193 R195 R200 R202 R204 R206 R208 R210 R212 TP80 U23
-6V: C414-C421 NT42 NT43 R213-R216 TP83 TP84 U24
-5V0A: C412 C413 C422-C428 R217-R220 TP85 TP86 U25

### Ports
+3V3A_EN (in), +5V0A_EN (in), +6V_EN (in), +6V_SHUNT_+ (out), +6V_SHUNT_- (out), -5V0A_EN (in), -6V_EN (in), -6V_SHUNT_+ (out), -6V_SHUNT_- (out)

### Nets
+3V3A: C394.1 C395.1 C396.1 C397.1 TP80.1(A) U23.1(OUT) U23.3(SENSE/FB) U23.20(OUT)
+5V0A: C390.1 C391.1 C392.1 C393.1 TP79.1(A) U22.1(OUT) U22.3(SENSE/FB) U22.20(OUT)
+6V: C399.1 C402.1 C407.1 C408.1 C409.1 C410.1 C411.1 NT41.1 R186.1 R188.1 TP81.1(A) U22.15(IN) U22.16(IN) U23.15(IN) U23.16(IN)
+12V: C405.1 C406.1 C414.1 C415.1 C416.1 NT42.1 R213.1 U21.1(VIN)
-5V0A: C412.1 C425.1 C426.1 C427.1 C428.1 R218.1 TP85.1(A) U25.1(OUT) U25.20(OUT)
-6V: C417.1 C418.1 C419.1 C420.1 C421.1 C422.1 C423.1 C424.1 TP83.1(A) U24.5(VOUT) U25.15(IN) U25.16(IN)
GND: C390.2 C391.2 C392.2 C393.2 C394.2 C395.2 C396.2 C397.2 C398.2 C399.2 C400.2 C401.2 C402.2 C403.2 C404.2 C405.2 C406.2 C407.2 C408.2 C409.2 C410.2 C411.2 C413.2 C414.2 C415.2 C416.2 C417.2 C418.2 C419.2 C420.2 C421.2 C422.2 C423.2 C424.2 C425.2 C426.2 C427.2 C428.2 R192.2 R193.2 R194.2 R195.2 R196.2 R197.2 R198.2 R199.2 R200.2 R201.2 R202.2 R203.2 R204.2 R205.2 R206.2 R207.2 R208.2 R209.2 R210.2 R211.2 R212.2 R215.2 R216.2 R219.2 R220.2 TP82.1(A) TP84.1(A) TP86.1(A) U21.4(AGND) U21.8(PGND) U22.7(GND) U22.E1(PAD) U23.7(GND) U23.E1(PAD) U24.1(GND) U25.2(NC) U25.4(NC) U25.5(NC) U25.6(NC) U25.7(GND) U25.8(NC) U25.9(NC) U25.10(NC) U25.11(NC) U25.12(NC) U25.17(NC) U25.18(NC) U25.19(NC) U25.21(EP)
+3V3A_EN: R190.2 ; port +3V3A_EN
+5V0A_EN: R189.2 ; port +5V0A_EN
+6V_EN: R187.2 R197.1 ; port +6V_EN
+6V_SHUNT_+: NT41.2 ; port +6V_SHUNT_+
+6V_SHUNT_-: NT40.2 ; port +6V_SHUNT_-
-5V0A_EN: R217.2 R219.1 ; port -5V0A_EN
-6V_EN: R214.2 R215.1 ; port -6V_EN
-6V_SHUNT_+: NT43.2 ; port -6V_SHUNT_+
-6V_SHUNT_-: NT42.2 ; port -6V_SHUNT_-
NetC398_1: C398.1 U21.6(SS/TRK)
NetC400_1: C400.1 C401.1 U22.14(NR)
NetC403_1: C403.1 C404.1 U23.14(NR)
NetC412_2: C412.2 R218.2 R220.1 U25.3(FB)
NetC413_1: C413.1 U25.14(NR/SS)
NetNT40_1: NT40.1 R186.2 U21.7(VOUT)
NetNT43_1: NT43.1 R213.2 U24.2(VIN)
NetR187_1: R187.1 U21.3(EN)
NetR188_2: R188.2 R191.2
NetR189_1: R189.1 U22.13(EN)
NetR190_1: R190.1 U23.13(EN)
NetR191_1: R191.1 R196.1 U21.5(FB)
NetR192_1: R192.1 U22.12(0P1V)
NetR193_1: R193.1 U23.12(0P1V)
NetR194_1: R194.1 U22.11(0P2V)
NetR195_1: R195.1 U23.11(0P2V)
NetR198_1: R198.1 U21.2(SYNC)
NetR199_1: R199.1 U22.10(0P4V)
NetR200_1: R200.1 U23.10(0P4V)
NetR201_1: R201.1 U22.9(0P8V)
NetR202_1: R202.1 U23.9(0P8V)
NetR203_1: R203.1 U22.8(1P6V)
NetR204_1: R204.1 U23.8(1P6V)
NetR205_1: R205.1 U22.6(3P2V)
NetR206_1: R206.1 U23.6(3P2V)
NetR207_1: R207.1 U22.2(NC) U22.17(NC) U22.18(NC) U22.19(NC)
NetR208_1: R208.1 U23.2(NC) U23.17(NC) U23.18(NC) U23.19(NC)
NetR209_1: R209.1 U22.5(6P4V1)
NetR210_1: R210.1 U23.5(6P4V1)
NetR211_1: R211.1 U22.4(6P4V2)
NetR212_1: R212.1 U23.4(6P4V2)
NetR214_1: R214.1 U24.3(INHIBIT)
NetR216_1: R216.1 U24.4(ADJ)
NetR217_1: R217.1 U25.13(EN)

### Notes on the sheet
- Vo = Vref * (1 + R1 / R2)
  Vref = 0.796V
- Vo = 6V  ;  R2 = 4K7
  R1 = R2 * (Vo / Vref - 1)
  R1 = 25K
- (near R207) NC pins can be tied to GND
- (near R208) NC pins can be tied to GND
- tss = 100000 * Cnr * ln((Vout + 5) / 5)
- (near U22) 1.4V added to selected voltage
- (near U23) 1.4V added to selected voltage
- tss = 100000 * 1µF * ln((1.5V + 5V) / 5V)
  tss = 26.2ms
- Rset = -4.24k * (Vo + 16.6V) / (Vo + 1.734V)
- (near R216) Rset = -4.24K * (-6V + 16.6V) / (-6V + 1.734)
  Rset = 10K5
- (near R219) EN pin can be enabled from a positive voltage source
  (datasheet p.13)
- (near R219) Connect this EN to a +3V3 bank
- Vref = -1.175V
- ADC
  IAVDD (Analog Supply): 320mA @ 3V3A
  IDRVDD (LVDS Supply): 165mA @ 1V8A
- tss (ms) = Cnr * 1.2 (nF)
- tss = 1.2 * 47nF
  tss = 56.4ms
- R1 = 47K
  R2 = 25K
  Vo = 3V384
- DAC
  AVDD33: 60mA @ +3V3A
  CVDD18: 60mA  @ +1V8A
  DVDD18: 350mA  @ +1V8A
- OpAmp
  +Vs Quiescent: 15mA @ +5V0A
  -Vs Quiescent: 15mA @ -5V0A
  Load: 66mA @ +5V0A
  Load: 66mA @ -5V0A
- OpAmp
  Quiescent Current: 25mA @ +5V0A
  Quiescent Current: 25mA @ -5V0A
- Sheet Name
- Project Title
- Global Project
- Revision
- Size
- Date
- Group
- Sheet
- of
- Filename
- Designers
- (in symbol REG_LDO_TPS7A3301RGWR) LDO
- (in symbol REG_SWR_PTN04050AAZT) SWR

### Library data of the parts
C390-C392 C394-C396 C405 C409 C410 C415 C419 = CAP_CER: as C462 on sheet POWER_FPGA; Operating Temperature: -55C - 125C; Temperature Coefficient: X7R; ComponentLink1Description: Digikey; ComponentLink1URL: https://www.digikey.ca/en/products/detail/tdk-corporation/CGA9P3X7R1H226M250KB/10240627; ComponentLink2Description: Datasheet; ComponentLink2URL: https://product.tdk.com/system/files/dam/doc/product/capacitor/ceramic/mlcc/charasheet/cga9p3x7r1h226m250kb.pdf; Tolerance: 20%; Ratings: AEC-Q200; Part#: CGA9P3X7R1H226M250KB; Supplier 1: Arrow Electronics; Supplier Part Number 1: CGA9P3X7R1H226M250KB; ComponentLink3Description: TDK; ComponentLink3URL: https://product.tdk.com/en/search/capacitor/ceramic/mlcc/info?part_no=CGA9P3X7R1H226M250KB; ComponentLink4Description: Octopart; ComponentLink4URL: https://octopart.com/cga9p3x7r1h226m250kb-tdk-102764996?r=sp
C393 C397 C398 C420 = CAP_CER: as C458-C460 on sheet POWER_FPGA; Operating Temperature: -55C - 125C; Temperature Coefficient: X7R; ComponentLink1Description: Digikey; ComponentLink1URL: [Digikey Link]; Part#: CGA3E3X7R1H474K080AB; ComponentLink2Description: Datasheet; ComponentLink2URL: [Datasheet Link]; Tolerance: 10%; Ratings: AEC-Q200
C399 C402 C422 C426 = CAP_CER: as C443 on sheet POWER_DDR3; Operating Temperature: -55C - 85C; Temperature Coefficient: X5R; ComponentLink1Description: Digikey; ComponentLink1URL: [Digikey Link]; ComponentLink2Description: Datasheet; ComponentLink2URL: [Datasheet Link]; Tolerance: 10%; Ratings: AEC-Q200; Supplier 1: Arrow Electronics; Supplier Part Number 1: GRT31CR61H106KE01L; Part#: GRT31CR61H106KE01L
C400 C403 C406 C416 = CAP_CER: as C466 on sheet POWER_FPGA; Operating Temperature: -55C - 125C; Temperature Coefficient: X7R; ComponentLink1Description: Digikey; ComponentLink1URL: [Digikey Link]; Part#: GCJ31CR71H105KA12L; ComponentLink2Description: Datasheet; ComponentLink2URL: [Datasheet Link]; Tolerance: 10%; Ratings: AEC-Q200
C401 C404 C412 C413 = CAP_CER: as C442 on sheet POWER_DDR3; Operating Temperature: -55C - 125C; Temperature Coefficient: X7R; ComponentLink1Description: Digikey; ComponentLink1URL: [Digikey Link]; Part#: GCM155R71H473KE02J; ComponentLink2Description: Datasheet; ComponentLink2URL: [Datasheet Link]; Tolerance: 10%; Ratings: AEC-Q200
C407 C408 C414 C417 = CAP_ALU_MAL215099101E3: as C461 on sheet POWER_FPGA; Mfg Part Number: MAL215099101E3; HelpURL: http://www.vishay.com/docs/28395/150crz.pdf; CreatedBy: Jonathan Bouchard; Temperature: -55°C to 125°C; Power: *; Supplier 1: Digikey; Supplier Part Number 1: 4399PHDKR-ND; Precision: 20%
C411 C421 C423 C424 C427 C428 = CAP_CER: as C464 on sheet POWER_FPGA; Operating Temperature: -55C - 125C; Temperature Coefficient: X7R; ComponentLink1Description: Digikey; ComponentLink1URL: [Digikey Link]; Part#: GCM155R71H104KE02J; ComponentLink2Description: Datasheet; ComponentLink2URL: [Datasheet Link]; Tolerance: 10%; Ratings: AEC-Q200
C418 C425 = CAP_CER: CGA9N1X7R1V476M230KC / 2220 47uF 20% X7R Ceramic Capacitor; Mfr: TDK; Operating Temperature: -55C - 125C; Temperature Coefficient: X7R; ComponentLink1Description: Digikey; ComponentLink1URL: https://www.digikey.ca/en/products/detail/tdk-corporation/CGA9N1X7R1V476M230KC/15930202; ComponentLink2Description: Datasheet; ComponentLink2URL: https://product.tdk.com/system/files/dam/doc/product/capacitor/ceramic/mlcc/catalog/mlcc_automotive_general_en.pdf; Tolerance: 20%; Ratings: AEC-Q200; Part#: CGA9N1X7R1V476M230KC; ComponentLink3Description: TDK; ComponentLink3URL: https://product.tdk.com/en/search/capacitor/ceramic/mlcc/info?part_no=CGA9N1X7R1V476M230KC; ComponentLink4Description: Octopart; ComponentLink4URL: https://octopart.com/cga9n1x7r1v476m230kc-tdk-122377816?r=sp; Supplier 1: Newark; Supplier Part Number 1: 57AK9414
NT40-NT43 = NET_TIE_SMALL
R186 R213 = RESISTOR: Part #: CSRN2512FKR500; Automotive: AEC-Q200; Operating Temperature: -55C - 155C; ComponentLink1Description: Digikey; ComponentLink1URL: https://www.digikey.ca/fr/products/detail/stackpole-electronics-inc/CSRN2512FKR500/1742768
R187-R196 R198-R206 R209-R212 R214 R216-R218 R220 = RESISTOR: Automotive: AEC-Q200; Operating Temperature: *; # Digikey: *; ComponentLink1Description: Digikey; ComponentLink1URL: *; # Manufacturer: *
R197 R207 R208 R215 R219 = RESISTOR: 1M 0402 1% 1/16W Resistor; Automotive: AEC-Q200; Operating Temperature: *; # Digikey: *; ComponentLink1Description: Digikey; ComponentLink1URL: *; # Manufacturer: *
TP79-TP83 TP85 = TESTPOINT: Test Point; ClassName: Testpoint
TP84 TP86 = TESTPOINT_PAD: Test Point
U21 = REG_SWR_LMZ23605TZE/NOPB: as U29 on sheet POWER_FPGA; Tolerance: *; Current Rating: 5A; Power Max: *; HelpURL: http://www.ti.com/lit/ds/symlink/lmz23605.pdf; CreatedBy/Date: Arnaud Samson - 05/07/18; VerifiedBy: Jonathan Bouchard 2018-07-13; Temperature: -40°C ~ 125°C; Package: TO-PMOD-7; Manufacturer #2: *; Assembly Type: SMD; Part Number #2: *; Part Number #1: LMZ23605TZE/NOPB; Polarized: YES; Supplier 1: Digi-Key; Supplier Part Number 1: 296-35357-1-ND
U22 U23 = REG_LDO_TPS7A4701RGWR: as U28 on sheet POWER_DDR3; Assembly Type: SMD; CreatedBy/Date: L-P Gauthier / 2018-05-29; Current Rating: 1A; Manufacturer #2: TBD; Part Number #1: TPS7A4701RGWR; Part Number #2: TBD; Package: 20-VQFN Exposed Pad; Power Max: *; Tolerance: -; Supplier 1: Digi-Key; Supplier Part Number 1: 296-37224-1-ND; VerifiedBy: Caroline Paulin - 28 sept 2018; Temperature: -40°C ~ 125°C; HelpURL: http://www.ti.com/lit/ds/symlink/tps7a47.pdf; Cryo: UNKNOWN
U24 = REG_SWR_PTN04050AAZT: REG - SWR -15 ~ -3.3V 1A 6W - 5-SMD; Manufacturer #1: Texas Instruments; Voltage Rating: 2.9V~7Vin; GRAMS Lib Spec: 2.8; Magnetic Material: Unknown; Polarized: Yes; Value: -15 ~ -3.3V; Tolerance: *; Current Rating: 1A; Power Max: 6W; HelpURL: http://www.ti.com/lit/ds/symlink/ptn04050a.pdf; CreatedBy/Date: Ihsane Najahi 2019-09-25; VerifiedBy: C.Paulin (9-10-2019); Temperature: -40°C ~ 85°C; Package: 5-SMD; Manufacturer #2: *; Note: *; Assembly Type: 5-SMD; Part Number #2: *; Part Number #1: PTN04050AAZT; Supplier 1: Digi-Key; Supplier Part Number 1: 296-32208-1-ND; Cryo: UNKNOWN
U25 = REG_LDO_TPS7A3301RGWR: REG - LDO Negative Adjustable 1 Output -1.18V-33V 1A -  20-VQFN (5x5); Manufacturer #1: Texas Instruments; Value: -1.18V~-33V; Voltage Rating: -36V; GRAMS Lib Spec: 2.8; Magnetic Material: Unknown; Polarized: Yes; Tolerance: *; Current Rating: 1A; Power Max: *; HelpURL: http://www.ti.com/lit/ds/symlink/tps7a33.pdf; CreatedBy/Date: Keven Deslandes - 2018/10/11; VerifiedBy: Caroline Paulin - 11/12/2018; Temperature: -40°C ~ 125°C; Package: 20-VQFN; Manufacturer #2: *; Assembly Type: SMD; Part Number #2: *; Part Number #1: TPS7A3301RGWR; Supplier 1: Digi-Key; Supplier Part Number 1: 296-39502-1-ND; Cryo: UNKNOWN